# Altium schematic sheet 2_Power.SchDoc
size A4; SheetNumber: 2; SheetTotal: 5
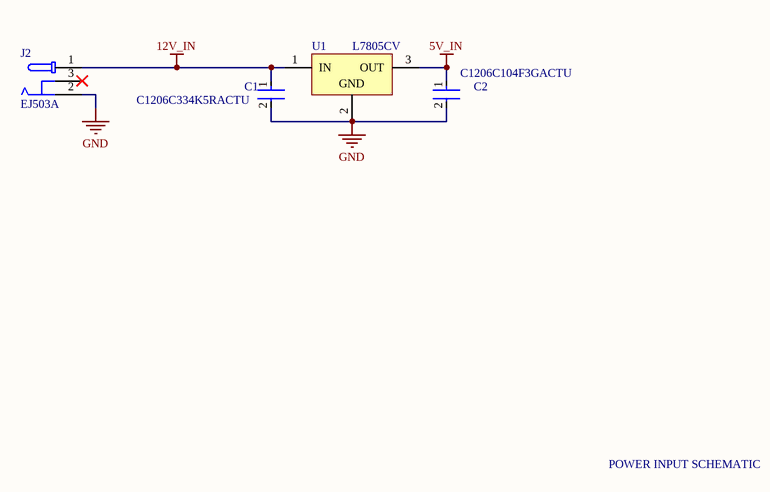
[diagram p0: 2_Power.SchDoc]

## Parts
C1  C1206C334K5RACTU  [FP-C1206C-EB-MFG]
C2  C1206C104F3GACTU  [FP-C1206C-EB-MFG]
J2  EJ503A  [MPD_EJ503A]
U1  L7805CV  [TO220]

## Nets
5V_IN: C2.1 U1.3(OUT)
12V_IN: C1.1 J2.1 U1.1(IN)
GND: C1.2 C2.2 J2.2 U1.2(GND)

Not connected (* = marked no-connect by the designer): J2 3*

## Notes on the sheet
- POWER INPUT SCHEMATIC

## Library data of the parts
C1 = CMP-1037-04487-2: CAP CER 0.33UF 50V X7R 1206; Manufacturer: KEMET; Tolerance: 0.1; Automotive Grade: Grade 0; Value: 0.33 μF; Material: Ceramic; Temperature Coefficient: 15%; Ipc Land Pattern Name: CAPC320160X78; Octopart: https://octopart.com/c1206c334k5ractu-kemet-146059; Height: 0.88mm; Package: C1206C-EB; Manufacturer Part Number: C1206C334K5RACTU; ComponentLink2Description: Datasheet; Digikey Description: CAP CER 0.33UF 50V X7R 1206; Voltage Rating: 50 V; Temperature Range High: +150°C; Temperature: -55°C to +150°C; Automotive: Yes; Lead Free: Yes; Mouser Description: Multilayer Ceramic Capacitors MLCC - SMD/SMT 50volts 0.33uF X7R 10%; Category: Cap; RoHS: TRUE; Temperature Characteristic: X7R; Capacitance: 0.33 μF; Device Class L1: Passive Components; Temperature Range Low: -55°C; Device Class L2: Capacitors; Device Class L3: Ceramic Capacitors; ComponentLink2URL: https://content.kemet.com/datasheets/KEM_C1007_X8R_ULTRA_150C_SMD.pdf
C2 = CMP-1037-04186-2: CAP CER 0.1UF 25V C0G/NP0 1206; Manufacturer: KEMET; Material: Ceramic; Value: 0.10 μF; Temperature Characteristic: C0G; Temperature Coefficient: 15%; Tolerance: 0.01; Automotive Grade: Grade 0; Device Class L3: Ceramic Capacitors; Voltage Rating: 25 V; Temperature Range Low: -55°C; RoHS: TRUE; Package: C1206C-EB; Category: Cap; Lead Free: Yes; Manufacturer Part Number: C1206C104F3GACTU; ComponentLink2URL: https://content.kemet.com/datasheets/KEM_C1007_X8R_ULTRA_150C_SMD.pdf; Ipc Land Pattern Name: CAPC320160X78; Temperature Range High: +150°C; Height: 0.88mm; Digikey Description: CAP CER 0.1UF 25V C0G/NP0 1206; ComponentLink2Description: Datasheet; Capacitance: 0.10 μF; Mouser Description: Multilayer Ceramic Capacitors MLCC - SMD/SMT 25volts 0.1uF 1% C0G; Octopart: https://octopart.com/c1206c104f3gactu-kemet-13149870; Device Class L1: Passive Components; Device Class L2: Capacitors; Automotive: Yes; Temperature: -55°C to +150°C
J2 = CMP-002-00071-1: Power Barrel Connector Jack 2.10mm ID (0.083), 5.50mm OD (0.217) Through Hole, Right Angle; MF: MPD; SnapEDA_Link: https://www.snapeda.com/parts/EJ503A/MPD+%2528Memory+Protection+Devices%2529/view-part/?ref=snap; Design Item ID: EJ503A; Purchase-URL: https://pricing.snapeda.com/search?q=EJ503A&ref=eda; Price: None; Component Type: Standard; Check_prices: https://www.snapeda.com/parts/EJ503A/MPD+%2528Memory+Protection+Devices%2529/view-part/?ref=eda; Case/Package: None; MP: EJ503A; Value: *; Pins: 3; Availability: In Stock; Source: EJ503A.SchLib
U1 = CMP-0244-00483-1: Positive Voltage Regulator, 5V, 3-Pin TO-220; PackageDescription: TO, Thru-Hole, Vertical, Heatsink Mounted; 3 In-Line Leads; Pitch 2.54 mm; ComponentLink2Description: Datasheet; PackageReference: TO220; ComponentLink3URL: http://www.st.com/internet/com/TECHNICAL_RESOURCES/TECHNICAL_LITERATURE/PACKAGE_INFORMATION/CD00004649.pdf; DatasheetVersion: 16/11/2011; ComponentLink1Description: Manufacturer URL; ComponentLink1URL: http://www.st.com; PackageVersion: ver3.0; ComponentLink3Description: Package Specification; ComponentLink2URL: http://www.st.com/internet/com/TECHNICAL_RESOURCES/TECHNICAL_LITERATURE/DATASHEET/CD00000444.pdf